# EAGLE schematic VOID01_REVA (EAGLE 7.7.0)

## Sheet 1 of 6: PI CM4
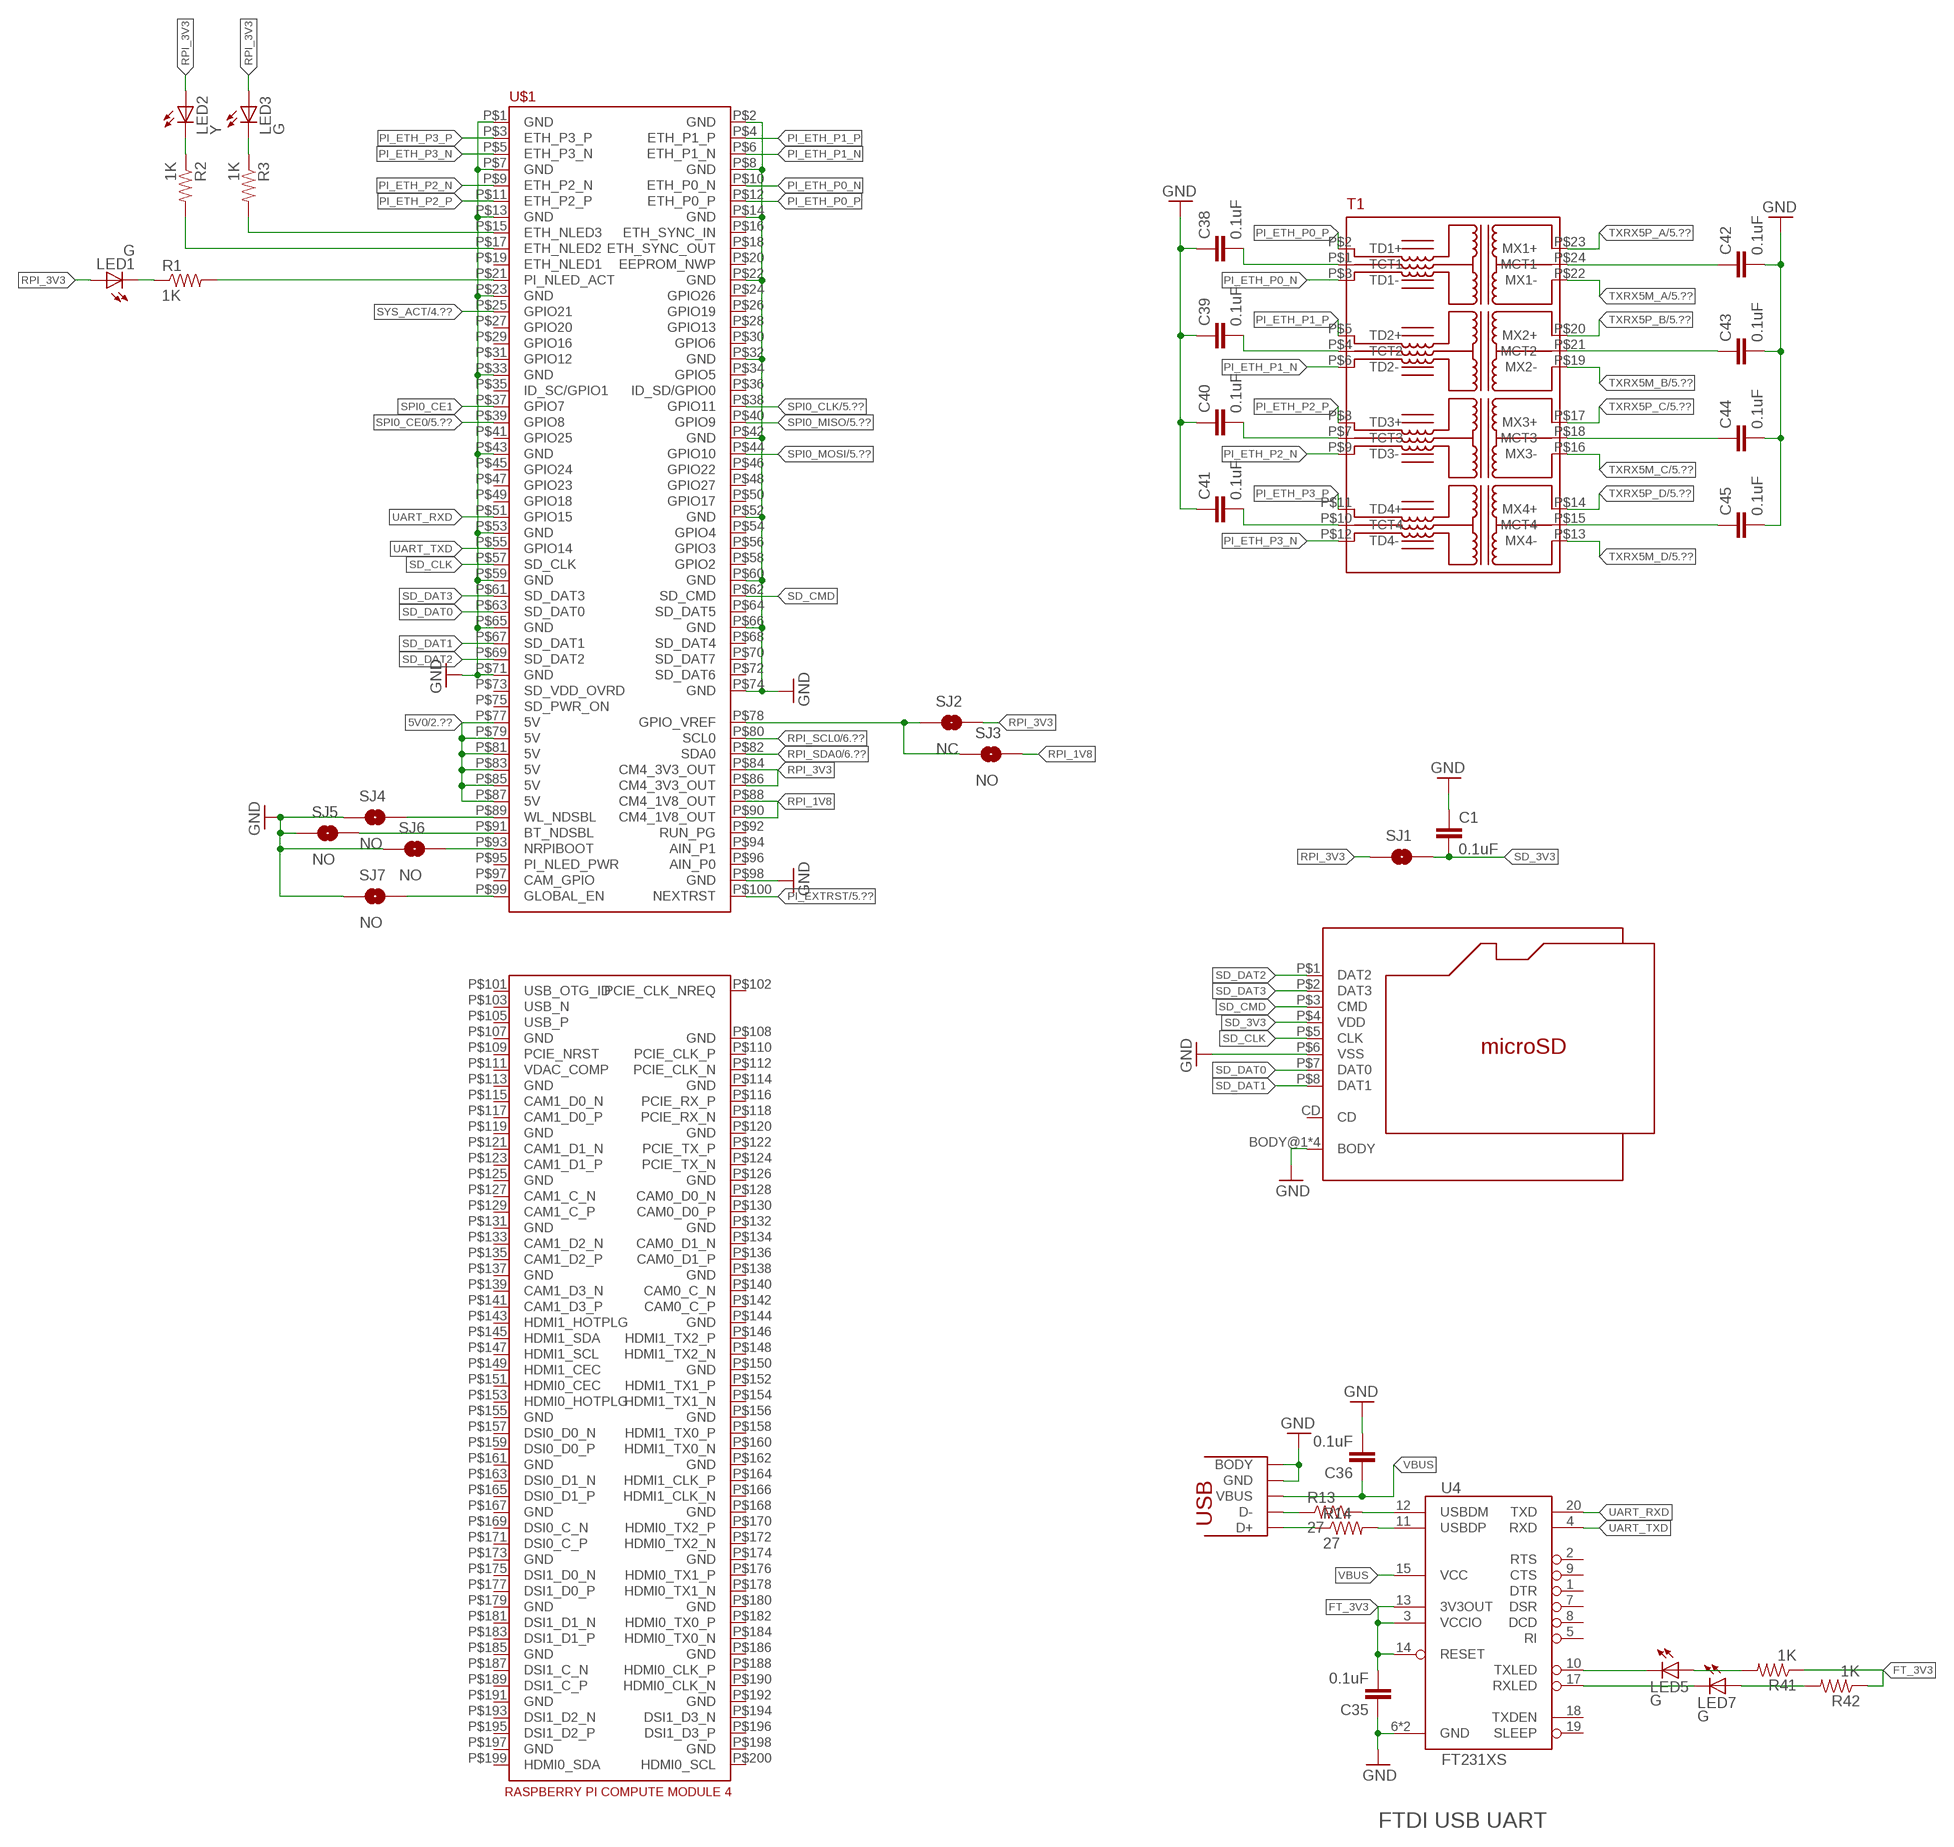
[diagram p0: schematic, sheet 1]

### Parts
C1  0.1uF  CAP0603-CAP  [0603-CAP]
C35  0.1uF  CAP0603-CAP  [0603-CAP]
C36  0.1uF  CAP0603-CAP  [0603-CAP]
C38  0.1uF  CAP0603-CAP  [0603-CAP]
C39  0.1uF  CAP0603-CAP  [0603-CAP]
C40  0.1uF  CAP0603-CAP  [0603-CAP]
C41  0.1uF  CAP0603-CAP  [0603-CAP]
C42  0.1uF  CAP0603-CAP  [0603-CAP]
C43  0.1uF  CAP0603-CAP  [0603-CAP]
C44  0.1uF  CAP0603-CAP  [0603-CAP]
C45  0.1uF  CAP0603-CAP  [0603-CAP]
J1  MICROSD  [MSD-4-A]
LED1  G  LED0603  [LED-0603]
LED2  Y  LED0603  [LED-0603]
LED3  G  LED0603  [LED-0603]
LED5  G  LED0603  [LED-0603]
LED7  G  LED0603  [LED-0603]
R1  1K  RESISTOR0402-RES  [0402-RES]
R2  1K  RESISTOR0402-RES  [0402-RES]
R3  1K  RESISTOR0402-RES  [0402-RES]
R13  27  RESISTOR0603-RES  [0603-RES]
R14  27  RESISTOR0603-RES  [0603-RES]
R41  1K  RESISTOR0603-RES  [0603-RES]
R42  1K  RESISTOR0603-RES  [0603-RES]
SJ1  SOLDERJUMPERTRACE  [SJ_2S-TRACE]
SJ2  NC  SOLDERJUMPERTRACE  [SJ_2S-TRACE]
SJ3  NO  SOLDERJUMPERNO  [SJ_2S-NO]
SJ4  NO  SOLDERJUMPERNO  [SJ_2S-NO]
SJ5  NO  SOLDERJUMPERNO  [SJ_2S-NO]
SJ6  NO  SOLDERJUMPERNO  [SJ_2S-NO]
SJ7  NO  SOLDERJUMPERNO  [SJ_2S-NO]
T1  HX6098NL  [HX6098NL]
U4  FT231XS  [SSOP-20]
U$1  RPI-CM4  [RPI-CM4]
U$2  USB-MICROB  [USB-MICROB-10118192]

### Nets
5V0: U$1.P$77(5V) U$1.P$79(5V) U$1.P$81(5V) U$1.P$83(5V) U$1.P$85(5V) U$1.P$87(5V) ; also sheet 2,4
FT_3V3: C35.2 R41.1 R42.1 U4.3(VCCIO) U4.13(3V3OUT) U4.14(RESET)
GND: C1.1 C35.1 C36.2 C38.1 C39.1 C40.1 C41.1 C42.2 C43.2 C44.2 C45.2 J1.BODY@1(BODY) J1.BODY@2(BODY) J1.BODY@3(BODY) J1.BODY@4(BODY) J1.P$6(VSS) SJ4.1 SJ5.1 SJ6.1 SJ7.1 U4.6(GND) U4.16(GND) U$1.P$1(GND) U$1.P$2(GND) U$1.P$7(GND) U$1.P$8(GND) U$1.P$13(GND) U$1.P$14(GND) U$1.P$22(GND) U$1.P$23(GND) U$1.P$32(GND) U$1.P$33(GND) U$1.P$42(GND) U$1.P$43(GND) U$1.P$52(GND) U$1.P$53(GND) U$1.P$59(GND) U$1.P$60(GND) U$1.P$65(GND) U$1.P$66(GND) U$1.P$71(GND) U$1.P$74(GND) U$1.P$98(GND) U$2.5(GND) U$2.BODY@1(BODY) U$2.BODY@2(BODY) U$2.BODY@3(BODY) U$2.BODY@4(BODY) U$2.BODY@5(BODY) U$2.BODY@6(BODY) ; also sheet 2,3,4,5,6
N$1: SJ2.1 SJ3.1 U$1.P$78(GPIO_VREF)
N$2: SJ4.2 U$1.P$89(WL_NDSBL)
N$3: SJ5.2 U$1.P$91(BT_NDSBL)
N$4: LED2.C R2.1
N$5: SJ6.2 U$1.P$93(NRPIBOOT)
N$6: R1.2 U$1.P$21(PI_NLED_ACT)
N$7: LED1.C R1.1
N$8: LED3.C R3.1
N$9: R2.2 U$1.P$17(ETH_NLED2)
N$10: R3.2 U$1.P$15(ETH_NLED3)
N$26: SJ7.2 U$1.P$99(GLOBAL_EN)
N$28: R13.1 U$2.2(D-)
N$29: R14.1 U$2.3(D+)
N$30: R14.2 U4.11(USBDP)
N$31: R13.2 U4.12(USBDM)
N$37: C38.2 T1.P$1(TCT1)
N$38: C39.2 T1.P$4(TCT2)
N$39: C40.2 T1.P$7(TCT3)
N$40: C41.2 T1.P$10(TCT4)
N$41: C45.1 T1.P$15(MCT4)
N$42: C44.1 T1.P$18(MCT3)
N$43: C43.1 T1.P$21(MCT2)
N$44: C42.1 T1.P$24(MCT1)
N$55: LED5.C U4.10(TXLED)
N$58: LED5.A R41.2
N$61: LED7.C U4.17(RXLED)
N$62: LED7.A R42.2
PI_ETH_P0_N: T1.P$3(TD1-) U$1.P$10(ETH_P0_N)
PI_ETH_P0_P: T1.P$2(TD1+) U$1.P$12(ETH_P0_P)
PI_ETH_P1_N: T1.P$6(TD2-) U$1.P$6(ETH_P1_N)
PI_ETH_P1_P: T1.P$5(TD2+) U$1.P$4(ETH_P1_P)
PI_ETH_P2_N: T1.P$9(TD3-) U$1.P$9(ETH_P2_N)
PI_ETH_P2_P: T1.P$8(TD3+) U$1.P$11(ETH_P2_P)
PI_ETH_P3_N: T1.P$12(TD4-) U$1.P$5(ETH_P3_N)
PI_ETH_P3_P: T1.P$11(TD4+) U$1.P$3(ETH_P3_P)
PI_EXTRST: U$1.P$100(NEXTRST) ; also sheet 5
RPI_1V8: SJ3.2 U$1.P$88(CM4_1V8_OUT) U$1.P$90(CM4_1V8_OUT)
RPI_3V3: LED1.A LED2.A LED3.A SJ1.1 SJ2.2 U$1.P$84(CM4_3V3_OUT) U$1.P$86(CM4_3V3_OUT)
RPI_SCL0: U$1.P$80(SCL0) ; also sheet 6
RPI_SDA0: U$1.P$82(SDA0) ; also sheet 6
SD_3V3: C1.2 J1.P$4(VDD) SJ1.2
SD_CLK: J1.P$5(CLK) U$1.P$57(SD_CLK)
SD_CMD: J1.P$3(CMD) U$1.P$62(SD_CMD)
SD_DAT0: J1.P$7(DAT0) U$1.P$63(SD_DAT0)
SD_DAT1: J1.P$8(DAT1) U$1.P$67(SD_DAT1)
SD_DAT2: J1.P$1(DAT2) U$1.P$69(SD_DAT2)
SD_DAT3: J1.P$2(DAT3) U$1.P$61(SD_DAT3)
SPI0_CE0: U$1.P$39(GPIO8) ; also sheet 5
SPI0_CE1: U$1.P$37(GPIO7)
SPI0_CLK: U$1.P$38(GPIO11) ; also sheet 5
SPI0_MISO: U$1.P$40(GPIO9) ; also sheet 5
SPI0_MOSI: U$1.P$44(GPIO10) ; also sheet 5
SYS_ACT: U$1.P$25(GPIO21) ; also sheet 4
TXRX5M_A: T1.P$22(MX1-) ; also sheet 5
TXRX5M_B: T1.P$19(MX2-) ; also sheet 5
TXRX5M_C: T1.P$16(MX3-) ; also sheet 5
TXRX5M_D: T1.P$13(MX4-) ; also sheet 5
TXRX5P_A: T1.P$23(MX1+) ; also sheet 5
TXRX5P_B: T1.P$20(MX2+) ; also sheet 5
TXRX5P_C: T1.P$17(MX3+) ; also sheet 5
TXRX5P_D: T1.P$14(MX4+) ; also sheet 5
UART_RXD: U4.20(TXD) U$1.P$51(GPIO15)
UART_TXD: U4.4(RXD) U$1.P$55(GPIO14)
VBUS: C36.1 U4.15(VCC) U$2.1(VBUS)
Unconnected: J1.CD U4.1(DTR) U4.2(RTS) U4.5(RI) U4.7(DSR) U4.8(DCD) U4.9(CTS) U4.18(TXDEN) U4.19(SLEEP) U$1.P$16(ETH_SYNC_IN) U$1.P$18(ETH_SYNC_OUT) U$1.P$19(ETH_NLED1) U$1.P$20(EEPROM_NWP) U$1.P$24(GPIO26) U$1.P$26(GPIO19) U$1.P$27(GPIO20) U$1.P$28(GPIO13) U$1.P$29(GPIO16) U$1.P$30(GPIO6) U$1.P$31(GPIO12) U$1.P$34(GPIO5) U$1.P$35(ID_SC/GPIO1) U$1.P$36(ID_SD/GPIO0) U$1.P$41(GPIO25) U$1.P$45(GPIO24) U$1.P$46(GPIO22) U$1.P$47(GPIO23) U$1.P$48(GPIO27) U$1.P$49(GPIO18) U$1.P$50(GPIO17) U$1.P$54(GPIO4) U$1.P$56(GPIO3) U$1.P$58(GPIO2) U$1.P$64(SD_DAT5) U$1.P$68(SD_DAT4) U$1.P$70(SD_DAT7) U$1.P$72(SD_DAT6) U$1.P$73(SD_VDD_OVRD) U$1.P$75(SD_PWR_ON) U$1.P$92(RUN_PG) U$1.P$94(AIN_P1) U$1.P$95(PI_NLED_PWR) U$1.P$96(AIN_P0) U$1.P$97(CAM_GPIO) U$1.P$101(USB_OTG_ID) U$1.P$102(PCIE_CLK_NREQ) U$1.P$103(USB_N) U$1.P$105(USB_P) U$1.P$107(GND) U$1.P$108(GND) U$1.P$109(PCIE_NRST) U$1.P$110(PCIE_CLK_P) U$1.P$111(VDAC_COMP) U$1.P$112(PCIE_CLK_N) U$1.P$113(GND) U$1.P$114(GND) U$1.P$115(CAM1_D0_N) U$1.P$116(PCIE_RX_P) U$1.P$117(CAM1_D0_P) U$1.P$118(PCIE_RX_N) U$1.P$119(GND) U$1.P$120(GND) U$1.P$121(CAM1_D1_N) U$1.P$122(PCIE_TX_P) U$1.P$123(CAM1_D1_P) U$1.P$124(PCIE_TX_N) U$1.P$125(GND) U$1.P$126(GND) U$1.P$127(CAM1_C_N) U$1.P$128(CAM0_D0_N) U$1.P$129(CAM1_C_P) U$1.P$130(CAM0_D0_P) U$1.P$131(GND) U$1.P$132(GND) U$1.P$133(CAM1_D2_N) U$1.P$134(CAM0_D1_N) U$1.P$135(CAM1_D2_P) U$1.P$136(CAM0_D1_P) U$1.P$137(GND) U$1.P$138(GND) U$1.P$139(CAM1_D3_N) U$1.P$140(CAM0_C_N) U$1.P$141(CAM1_D3_P) U$1.P$142(CAM0_C_P) U$1.P$143(HDMI1_HOTPLG) U$1.P$144(GND) U$1.P$145(HDMI1_SDA) U$1.P$146(HDMI1_TX2_P) U$1.P$147(HDMI1_SCL) U$1.P$148(HDMI1_TX2_N) U$1.P$149(HDMI1_CEC) U$1.P$150(GND) U$1.P$151(HDMI0_CEC) U$1.P$152(HDMI1_TX1_P) U$1.P$153(HDMI0_HOTPLG) U$1.P$154(HDMI1_TX1_N) U$1.P$155(GND) U$1.P$156(GND) U$1.P$157(DSI0_D0_N) U$1.P$158(HDMI1_TX0_P) U$1.P$159(DSI0_D0_P) U$1.P$160(HDMI1_TX0_N) U$1.P$161(GND) U$1.P$162(GND) U$1.P$163(DSI0_D1_N) U$1.P$164(HDMI1_CLK_P) U$1.P$165(DSI0_D1_P) U$1.P$166(HDMI1_CLK_N) U$1.P$167(GND) U$1.P$168(GND) U$1.P$169(DSI0_C_N) U$1.P$170(HDMI0_TX2_P) U$1.P$171(DSI0_C_P) U$1.P$172(HDMI0_TX2_N) U$1.P$173(GND) U$1.P$174(GND) U$1.P$175(DSI1_D0_N) U$1.P$176(HDMI0_TX1_P) U$1.P$177(DSI1_D0_P) U$1.P$178(HDMI0_TX1_N) U$1.P$179(GND) U$1.P$180(GND) U$1.P$181(DSI1_D1_N) U$1.P$182(HDMI0_TX0_P) U$1.P$183(DSI1_D1_P) U$1.P$184(HDMI0_TX0_N) U$1.P$185(GND) U$1.P$186(GND) U$1.P$187(DSI1_C_N) U$1.P$188(HDMI0_CLK_P) U$1.P$189(DSI1_C_P) U$1.P$190(HDMI0_CLK_N) U$1.P$191(GND) U$1.P$192(GND) U$1.P$193(DSI1_D2_N) U$1.P$194(DSI1_D3_N) U$1.P$195(DSI1_D2_P) U$1.P$196(DSI1_D3_P) U$1.P$197(GND) U$1.P$198(GND) U$1.P$199(HDMI0_SDA) U$1.P$200(HDMI0_SCL)

### Notes on the sheet
- FTDI USB UART

## Sheet 2 of 6: 5V SUPPLY
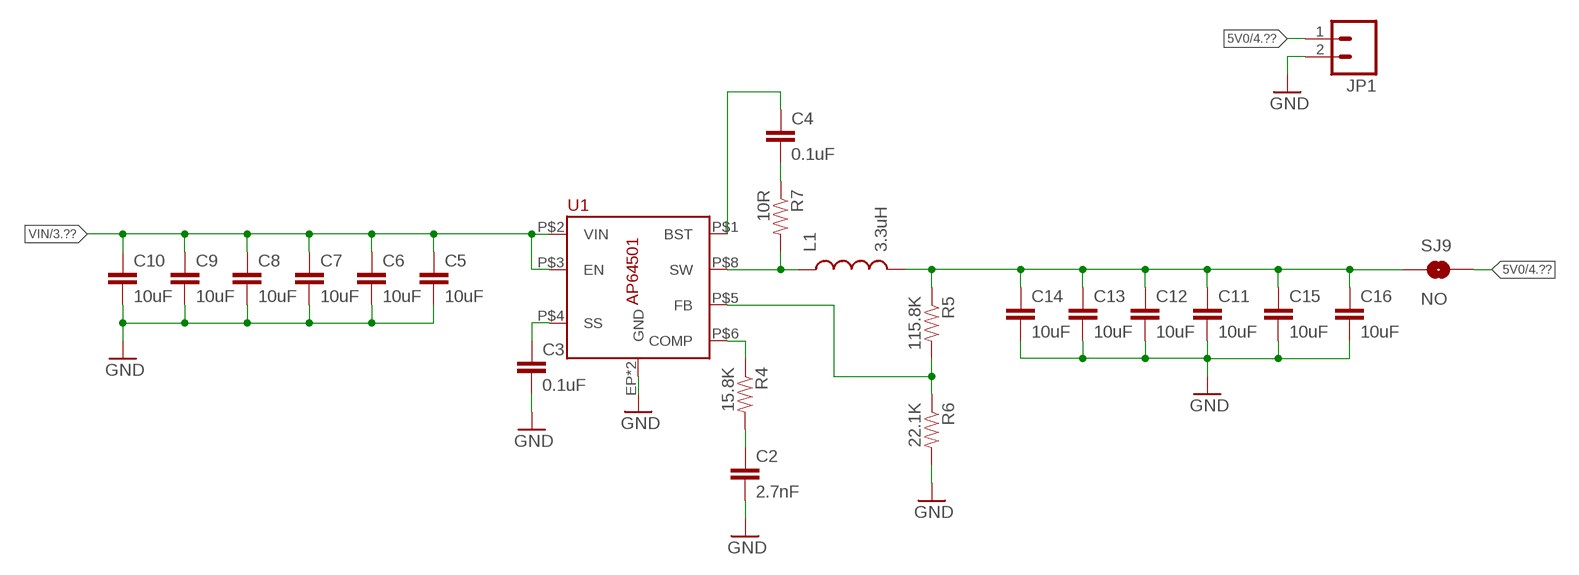
[diagram p1: schematic, sheet 2]

### Parts
C2  2.7nF  CAP0603-CAP  [0603-CAP]
C3  0.1uF  CAP0603-CAP  [0603-CAP]
C4  0.1uF  CAP0603-CAP  [0603-CAP]
C5  10uF  CAP1206  [1206]
C6  10uF  CAP1206  [1206]
C7  10uF  CAP1206  [1206]
C8  10uF  CAP1206  [1206]
C9  10uF  CAP1206  [1206]
C10  10uF  CAP1206  [1206]
C11  10uF  CAP1206  [1206]
C12  10uF  CAP1206  [1206]
C13  10uF  CAP1206  [1206]
C14  10uF  CAP1206  [1206]
C15  10uF  CAP1206  [1206]
C16  10uF  CAP1206  [1206]
JP1  M02PTH3  [1X02_LONGPADS]
L1  3.3uH  INDUCTORSRN6045TA  [SRN6045TA]
R4  15.8K  RESISTOR0603-RES  [0603-RES]
R5  115.8K  RESISTOR0603-RES  [0603-RES]
R6  22.1K  RESISTOR0603-RES  [0603-RES]
R7  10R  RESISTOR0603-RES  [0603-RES]
SJ9  NO  SOLDERJUMPERNO  [SJ_2S-NO]
U1  AP64501  [SO-8EP]

### Nets
5V0: JP1.1 SJ9.2 ; also sheet 1,4
GND: C2.2 C3.2 C5.2 C6.2 C7.2 C8.2 C9.2 C10.2 C11.2 C12.2 C13.2 C14.2 C15.2 C16.2 JP1.2 R6.2 U1.EP(GND) U1.P$7(GND) ; also sheet 1,3,4,5,6
N$11: C3.1 U1.P$4(SS)
N$12: R4.1 U1.P$6(COMP)
N$13: C2.1 R4.2
N$14: R5.2 R6.1 U1.P$5(FB)
N$17: L1.P$1 R7.2 U1.P$8(SW)
N$18: C4.2 R7.1
N$19: C4.1 U1.P$1(BST)
N$46: C11.1 C12.1 C13.1 C14.1 C15.1 C16.1 L1.P$2 R5.1 SJ9.1
VIN: C5.1 C6.1 C7.1 C8.1 C9.1 C10.1 U1.P$2(VIN) U1.P$3(EN) ; also sheet 3,4

## Sheet 3 of 6: 1V2 SUPPLY
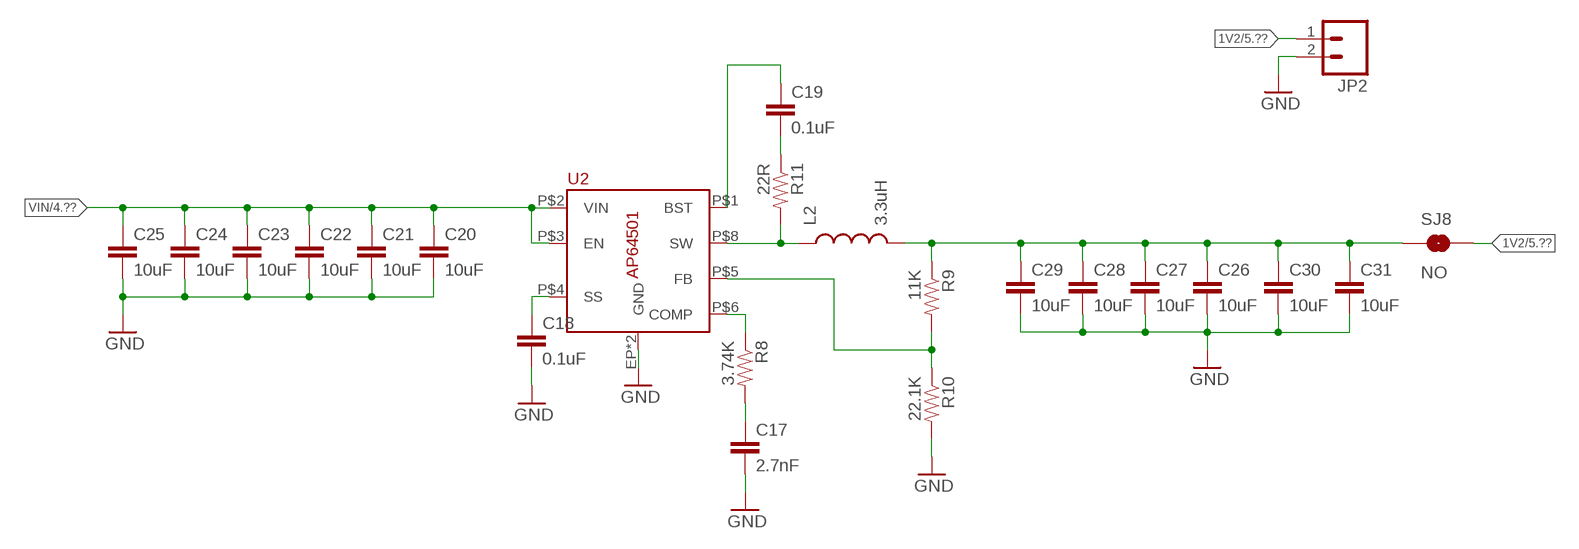
[diagram p2: schematic, sheet 3]

### Parts
C17  2.7nF  CAP0603-CAP  [0603-CAP]
C18  0.1uF  CAP0603-CAP  [0603-CAP]
C19  0.1uF  CAP0603-CAP  [0603-CAP]
C20  10uF  CAP1206  [1206]
C21  10uF  CAP1206  [1206]
C22  10uF  CAP1206  [1206]
C23  10uF  CAP1206  [1206]
C24  10uF  CAP1206  [1206]
C25  10uF  CAP1206  [1206]
C26  10uF  CAP1206  [1206]
C27  10uF  CAP1206  [1206]
C28  10uF  CAP1206  [1206]
C29  10uF  CAP1206  [1206]
C30  10uF  CAP1206  [1206]
C31  10uF  CAP1206  [1206]
JP2  M02PTH3  [1X02_LONGPADS]
L2  3.3uH  INDUCTORSRN6045TA  [SRN6045TA]
R8  3.74K  RESISTOR0603-RES  [0603-RES]
R9  11K  RESISTOR0603-RES  [0603-RES]
R10  22.1K  RESISTOR0603-RES  [0603-RES]
R11  22R  RESISTOR0603-RES  [0603-RES]
SJ8  NO  SOLDERJUMPERNO  [SJ_2S-NO]
U2  AP64501  [SO-8EP]

### Nets
1V2: JP2.1 SJ8.2 ; also sheet 5
GND: C17.2 C18.2 C20.2 C21.2 C22.2 C23.2 C24.2 C25.2 C26.2 C27.2 C28.2 C29.2 C30.2 C31.2 JP2.2 R10.2 U2.EP(GND) U2.P$7(GND) ; also sheet 1,2,4,5,6
N$15: C18.1 U2.P$4(SS)
N$16: R8.1 U2.P$6(COMP)
N$20: C17.1 R8.2
N$21: R9.2 R10.1 U2.P$5(FB)
N$22: L2.P$1 R11.2 U2.P$8(SW)
N$23: C19.2 R11.1
N$24: C19.1 U2.P$1(BST)
N$47: C26.1 C27.1 C28.1 C29.1 C30.1 C31.1 L2.P$2 R9.1 SJ8.1
VIN: C20.1 C21.1 C22.1 C23.1 C24.1 C25.1 U2.P$2(VIN) U2.P$3(EN) ; also sheet 2,4

## Sheet 4 of 6: INPUT & LDOs
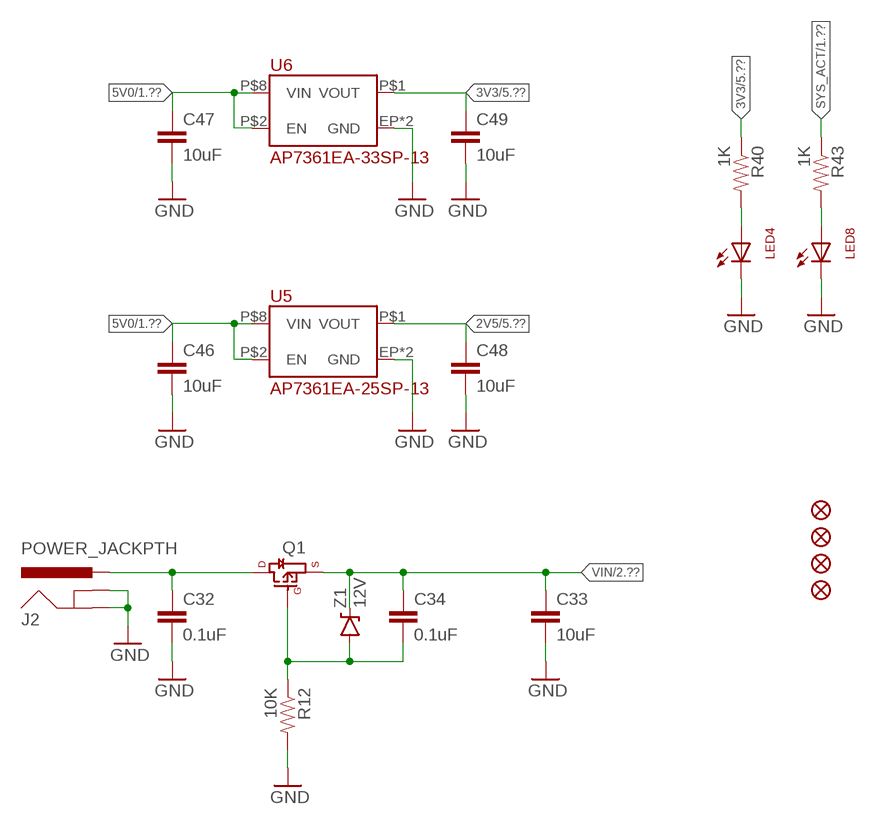
[diagram p3: schematic, sheet 4]

### Parts
C32  0.1uF  CAP0603-CAP  [0603-CAP]
C33  10uF  CAP1206  [1206]
C34  0.1uF  CAP0603-CAP  [0603-CAP]
C46  10uF  CAP1206  [1206]
C47  10uF  CAP1206  [1206]
C48  10uF  CAP1206  [1206]
C49  10uF  CAP1206  [1206]
FID1  FIDUCIAL  [FIDUCIAL]
FID2  FIDUCIAL  [FIDUCIAL]
FID3  FIDUCIAL  [FIDUCIAL]
FID4  FIDUCIAL  [FIDUCIAL]
J2  POWER_JACKPTH  [POWER_JACK_PTH]
LED4  LED  [LED_QBL7XX80D-MP4A]
LED8  LED  [LED_QBL7XX80D-MP4A]
Q1  MOSFET_P_CHANNELDMP4015SSS  [SO08]
R12  10K  RESISTOR0603-RES  [0603-RES]
R40  1K  RESISTOR0603-RES  [0603-RES]
R43  1K  RESISTOR0603-RES  [0603-RES]
U5  AP7361EA-25SP-13  AP7361EA_SO8_EP  [SO-8EP]
U6  AP7361EA-33SP-13  AP7361EA_SO8_EP  [SO-8EP]
Z1  12V  DIODE-ZENERSOT-23  [SOT-23]

### Nets
2V5: C48.1 U5.P$1(VOUT) ; also sheet 5
3V3: C49.1 R40.1 U6.P$1(VOUT) ; also sheet 5,6
5V0: C46.1 C47.1 U5.P$2(EN) U5.P$8(VIN) U6.P$2(EN) U6.P$8(VIN) ; also sheet 1,2
GND: C32.2 C33.2 C46.2 C47.2 C48.2 C49.2 J2.GND J2.GNDBREAK LED4.C LED8.C R12.2 U5.EP(GND) U5.P$4(GND) U6.EP(GND) U6.P$4(GND) ; also sheet 1,2,3,5,6
N$25: C32.1 J2.PWR Q1.5(D) Q1.6(D) Q1.7(D) Q1.8(D)
N$27: C34.2 Q1.4(G) R12.1 Z1.1(A)
N$51: LED8.A R43.2
N$92: LED4.A R40.2
SYS_ACT: R43.1 ; also sheet 1
VIN: C33.1 C34.1 Q1.1(S) Q1.2(S) Q1.3(S) Z1.3(C) ; also sheet 2,3

## Sheet 5 of 6: SWITCH
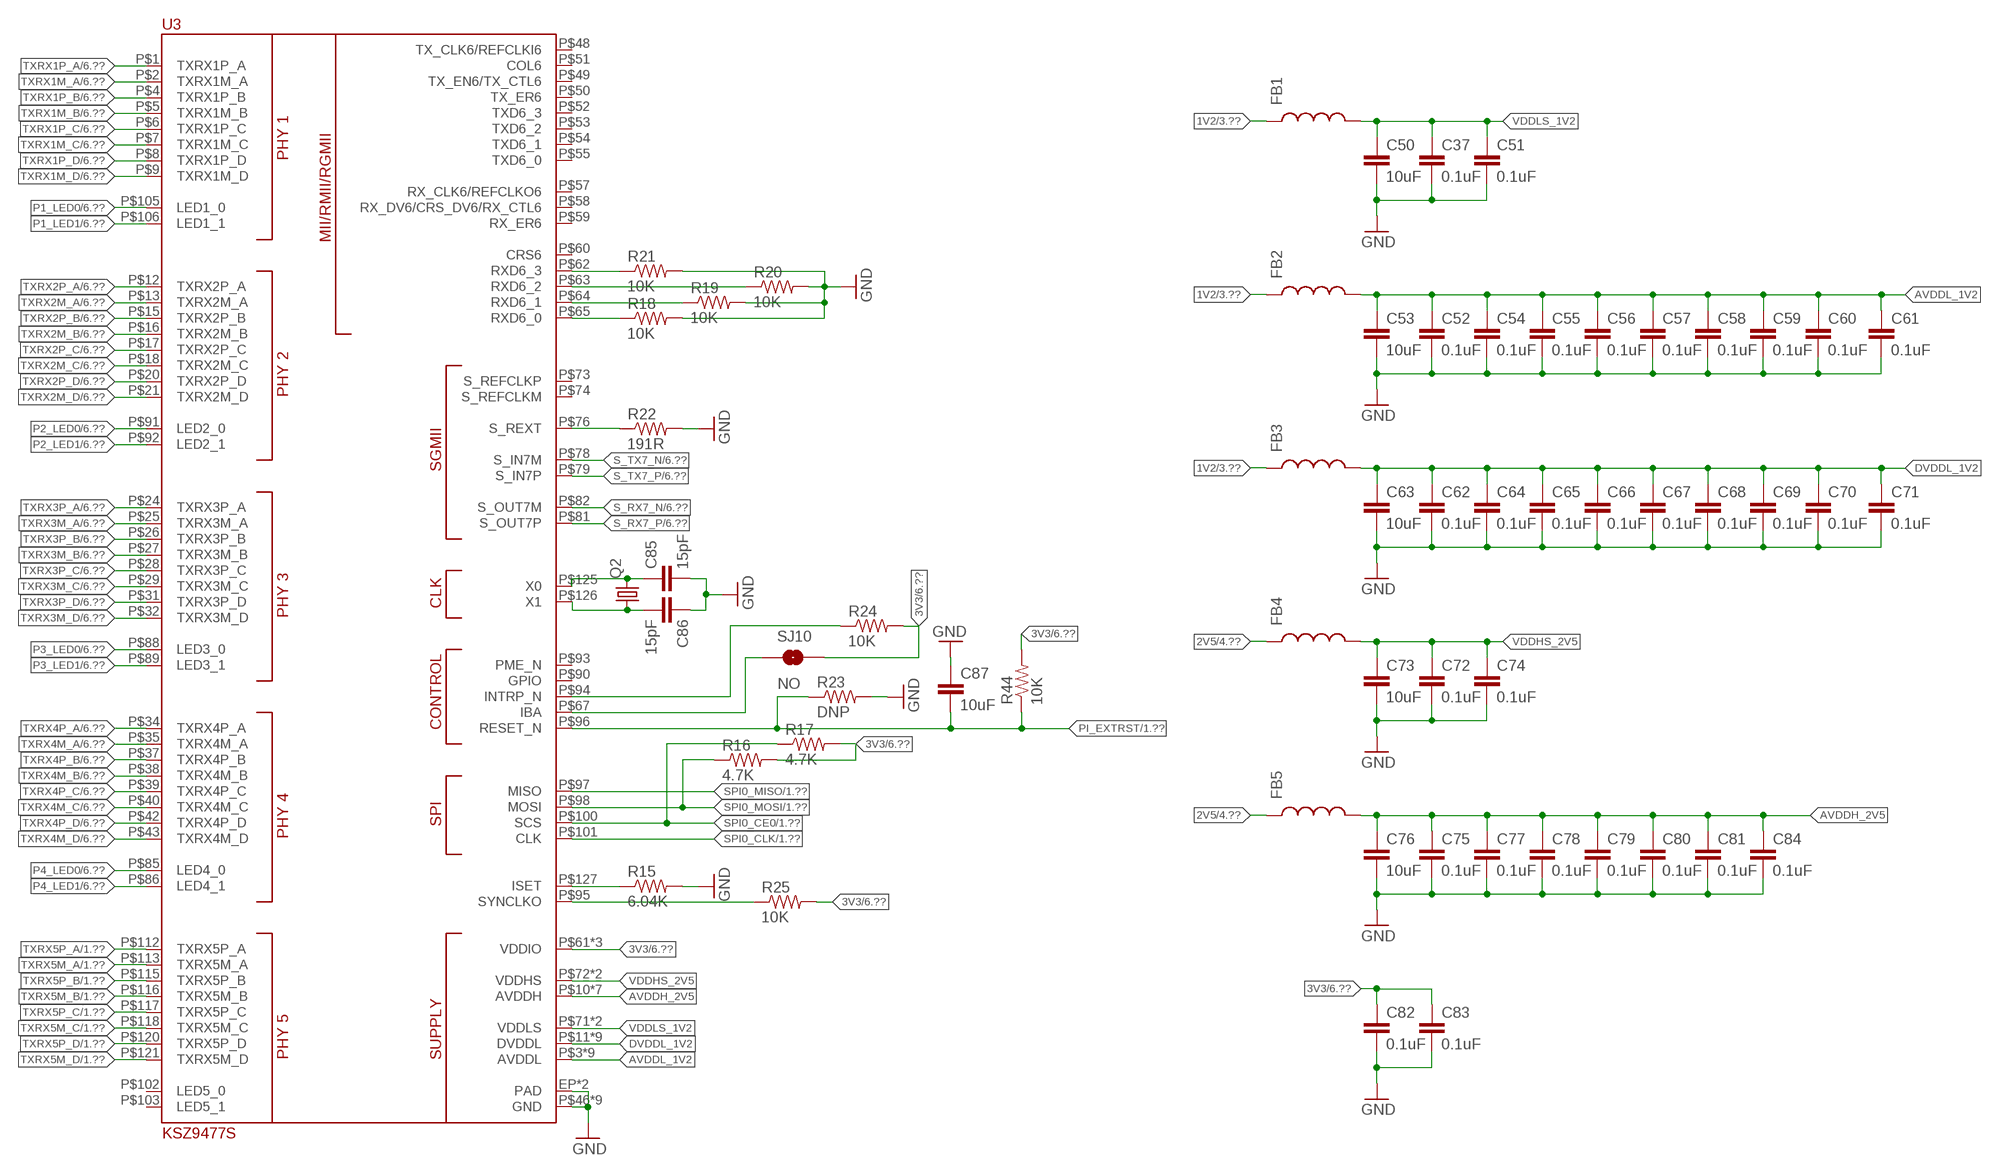
[diagram p4: schematic, sheet 5]

### Parts
C37  0.1uF  CAP0402-CAP  [0402-CAP]
C50  10uF  CAP1206  [1206]
C51  0.1uF  CAP0402-CAP  [0402-CAP]
C52  0.1uF  CAP0402-CAP  [0402-CAP]
C53  10uF  CAP1206  [1206]
C54  0.1uF  CAP0402-CAP  [0402-CAP]
C55  0.1uF  CAP0402-CAP  [0402-CAP]
C56  0.1uF  CAP0402-CAP  [0402-CAP]
C57  0.1uF  CAP0402-CAP  [0402-CAP]
C58  0.1uF  CAP0402-CAP  [0402-CAP]
C59  0.1uF  CAP0402-CAP  [0402-CAP]
C60  0.1uF  CAP0402-CAP  [0402-CAP]
C61  0.1uF  CAP0402-CAP  [0402-CAP]
C62  0.1uF  CAP0402-CAP  [0402-CAP]
C63  10uF  CAP1206  [1206]
C64  0.1uF  CAP0402-CAP  [0402-CAP]
C65  0.1uF  CAP0402-CAP  [0402-CAP]
C66  0.1uF  CAP0402-CAP  [0402-CAP]
C67  0.1uF  CAP0402-CAP  [0402-CAP]
C68  0.1uF  CAP0402-CAP  [0402-CAP]
C69  0.1uF  CAP0402-CAP  [0402-CAP]
C70  0.1uF  CAP0402-CAP  [0402-CAP]
C71  0.1uF  CAP0402-CAP  [0402-CAP]
C72  0.1uF  CAP0402-CAP  [0402-CAP]
C73  10uF  CAP1206  [1206]
C74  0.1uF  CAP0402-CAP  [0402-CAP]
C75  0.1uF  CAP0402-CAP  [0402-CAP]
C76  10uF  CAP1206  [1206]
C77  0.1uF  CAP0402-CAP  [0402-CAP]
C78  0.1uF  CAP0402-CAP  [0402-CAP]
C79  0.1uF  CAP0402-CAP  [0402-CAP]
C80  0.1uF  CAP0402-CAP  [0402-CAP]
C81  0.1uF  CAP0402-CAP  [0402-CAP]
C82  0.1uF  CAP0402-CAP  [0402-CAP]
C83  0.1uF  CAP0402-CAP  [0402-CAP]
C84  0.1uF  CAP0402-CAP  [0402-CAP]
C85  15pF  CAP0402-CAP  [0402-CAP]
C86  15pF  CAP0402-CAP  [0402-CAP]
C87  10uF  CAP1206  [1206]
FB1  INDUCTOR0805  [0805]
FB2  INDUCTOR0805  [0805]
FB3  INDUCTOR0805  [0805]
FB4  INDUCTOR0805  [0805]
FB5  INDUCTOR0805  [0805]
Q2  CRYSTAL3.2X2.5  [CRYSTAL_3.2X2.5]
R15  6.04K  RESISTOR0402-RES  [0402-RES]
R16  4.7K  RESISTOR0402-RES  [0402-RES]
R17  4.7K  RESISTOR0402-RES  [0402-RES]
R18  10K  RESISTOR0402-RES  [0402-RES]
R19  10K  RESISTOR0402-RES  [0402-RES]
R20  10K  RESISTOR0402-RES  [0402-RES]
R21  10K  RESISTOR0402-RES  [0402-RES]
R22  191R  RESISTOR0402-RES  [0402-RES]
R23  DNP  RESISTOR0402-RES  [0402-RES]
R24  10K  RESISTOR0402-RES  [0402-RES]
R25  10K  RESISTOR0402-RES  [0402-RES]
R44  10K  RESISTOR0402-RES  [0402-RES]
SJ10  NO  SOLDERJUMPERNO  [SJ_2S-NO]
U3  KSZ9477S  [TQFP-128-EP]

### Nets
1V2: FB1.1 FB2.1 FB3.1 ; also sheet 3
2V5: FB4.1 FB5.1 ; also sheet 4
3V3: C82.1 C83.1 R16.2 R17.2 R24.2 R25.2 R44.2 SJ10.2 U3.P$61(VDDIO) U3.P$68(VDDIO) U3.P$99(VDDIO) ; also sheet 4,6
AVDDH_2V5: C75.1 C76.1 C77.1 C78.1 C79.1 C80.1 C81.1 C84.1 FB5.2 U3.P$10(AVDDH) U3.P$22(AVDDH) U3.P$33(AVDDH) U3.P$44(AVDDH) U3.P$111(AVDDH) U3.P$122(AVDDH) U3.P$128(AVDDH)
AVDDL_1V2: C52.1 C53.1 C54.1 C55.1 C56.1 C57.1 C58.1 C59.1 C60.1 C61.1 FB2.2 U3.P$3(AVDDL) U3.P$14(AVDDL) U3.P$19(AVDDL) U3.P$30(AVDDL) U3.P$36(AVDDL) U3.P$41(AVDDL) U3.P$114(AVDDL) U3.P$119(AVDDL) U3.P$124(AVDDL)
DVDDL_1V2: C62.1 C63.1 C64.1 C65.1 C66.1 C67.1 C68.1 C69.1 C70.1 C71.1 FB3.2 U3.P$11(DVDDL) U3.P$23(DVDDL) U3.P$45(DVDDL) U3.P$56(DVDDL) U3.P$66(DVDDL) U3.P$70(DVDDL) U3.P$87(DVDDL) U3.P$104(DVDDL) U3.P$110(DVDDL)
GND: C37.2 C50.2 C51.2 C52.2 C53.2 C54.2 C55.2 C56.2 C57.2 C58.2 C59.2 C60.2 C61.2 C62.2 C63.2 C64.2 C65.2 C66.2 C67.2 C68.2 C69.2 C70.2 C71.2 C72.2 C73.2 C74.2 C75.2 C76.2 C77.2 C78.2 C79.2 C80.2 C81.2 C82.2 C83.2 C84.2 C85.2 C86.1 C87.1 R15.2 R18.2 R19.2 R20.2 R21.2 R22.2 R23.2 U3.EP1(PAD) U3.EP(PAD) U3.P$46(GND) U3.P$47(GND) U3.P$69(GND) U3.P$75(GND) U3.P$77(GND) U3.P$80(GND) U3.P$107(GND) U3.P$109(GND) U3.P$123(GND) ; also sheet 1,2,3,4,6
N$32: R15.1 U3.P$127(ISET)
N$33: R21.1 U3.P$62(RXD6_3)
N$34: R20.1 U3.P$63(RXD6_2)
N$35: R19.1 U3.P$64(RXD6_1)
N$36: R18.1 U3.P$65(RXD6_0)
N$45: R22.1 U3.P$76(S_REXT)
N$48: R25.1 U3.P$95(SYNCLKO)
N$81: R24.1 U3.P$94(INTRP_N)
N$82: SJ10.1 U3.P$67(IBA)
N$83: C86.2 Q2.P$1 U3.P$126(X1)
N$85: C85.1 Q2.P$3 U3.P$125(X0)
P1_LED0: U3.P$105(LED1_0) ; also sheet 6
P1_LED1: U3.P$106(LED1_1) ; also sheet 6
P2_LED0: U3.P$91(LED2_0) ; also sheet 6
P2_LED1: U3.P$92(LED2_1) ; also sheet 6
P3_LED0: U3.P$88(LED3_0) ; also sheet 6
P3_LED1: U3.P$89(LED3_1) ; also sheet 6
P4_LED0: U3.P$85(LED4_0) ; also sheet 6
P4_LED1: U3.P$86(LED4_1) ; also sheet 6
PI_EXTRST: C87.2 R23.1 R44.1 U3.P$96(RESET_N) ; also sheet 1
S_RX7_N: U3.P$82(S_OUT7M) ; also sheet 6
S_RX7_P: U3.P$81(S_OUT7P) ; also sheet 6
S_TX7_N: U3.P$78(S_IN7M) ; also sheet 6
S_TX7_P: U3.P$79(S_IN7P) ; also sheet 6
SPI0_CE0: R17.1 U3.P$100(SCS) ; also sheet 1
SPI0_CLK: U3.P$101(CLK) ; also sheet 1
SPI0_MISO: U3.P$97(MISO) ; also sheet 1
SPI0_MOSI: R16.1 U3.P$98(MOSI) ; also sheet 1
TXRX1M_A: U3.P$2(TXRX1M_A) ; also sheet 6
TXRX1M_B: U3.P$5(TXRX1M_B) ; also sheet 6
TXRX1M_C: U3.P$7(TXRX1M_C) ; also sheet 6
TXRX1M_D: U3.P$9(TXRX1M_D) ; also sheet 6
TXRX1P_A: U3.P$1(TXRX1P_A) ; also sheet 6
TXRX1P_B: U3.P$4(TXRX1P_B) ; also sheet 6
TXRX1P_C: U3.P$6(TXRX1P_C) ; also sheet 6
TXRX1P_D: U3.P$8(TXRX1P_D) ; also sheet 6
TXRX2M_A: U3.P$13(TXRX2M_A) ; also sheet 6
TXRX2M_B: U3.P$16(TXRX2M_B) ; also sheet 6
TXRX2M_C: U3.P$18(TXRX2M_C) ; also sheet 6
TXRX2M_D: U3.P$21(TXRX2M_D) ; also sheet 6
TXRX2P_A: U3.P$12(TXRX2P_A) ; also sheet 6
TXRX2P_B: U3.P$15(TXRX2P_B) ; also sheet 6
TXRX2P_C: U3.P$17(TXRX2P_C) ; also sheet 6
TXRX2P_D: U3.P$20(TXRX2P_D) ; also sheet 6
TXRX3M_A: U3.P$25(TXRX3M_A) ; also sheet 6
TXRX3M_B: U3.P$27(TXRX3M_B) ; also sheet 6
TXRX3M_C: U3.P$29(TXRX3M_C) ; also sheet 6
TXRX3M_D: U3.P$32(TXRX3M_D) ; also sheet 6
TXRX3P_A: U3.P$24(TXRX3P_A) ; also sheet 6
TXRX3P_B: U3.P$26(TXRX3P_B) ; also sheet 6
TXRX3P_C: U3.P$28(TXRX3P_C) ; also sheet 6
TXRX3P_D: U3.P$31(TXRX3P_D) ; also sheet 6
TXRX4M_A: U3.P$35(TXRX4M_A) ; also sheet 6
TXRX4M_B: U3.P$38(TXRX4M_B) ; also sheet 6
TXRX4M_C: U3.P$40(TXRX4M_C) ; also sheet 6
TXRX4M_D: U3.P$43(TXRX4M_D) ; also sheet 6
TXRX4P_A: U3.P$34(TXRX4P_A) ; also sheet 6
TXRX4P_B: U3.P$37(TXRX4P_B) ; also sheet 6
TXRX4P_C: U3.P$39(TXRX4P_C) ; also sheet 6
TXRX4P_D: U3.P$42(TXRX4P_D) ; also sheet 6
TXRX5M_A: U3.P$113(TXRX5M_A) ; also sheet 1
TXRX5M_B: U3.P$116(TXRX5M_B) ; also sheet 1
TXRX5M_C: U3.P$118(TXRX5M_C) ; also sheet 1
TXRX5M_D: U3.P$121(TXRX5M_D) ; also sheet 1
TXRX5P_A: U3.P$112(TXRX5P_A) ; also sheet 1
TXRX5P_B: U3.P$115(TXRX5P_B) ; also sheet 1
TXRX5P_C: U3.P$117(TXRX5P_C) ; also sheet 1
TXRX5P_D: U3.P$120(TXRX5P_D) ; also sheet 1
VDDHS_2V5: C72.1 C73.1 C74.1 FB4.2 U3.P$72(VDDHS) U3.P$83(VDDHS)
VDDLS_1V2: C37.1 C50.1 C51.1 FB1.2 U3.P$71(VDDLS) U3.P$84(VDDLS)
Unconnected: U3.P$48(TX_CLK6/REFCLKI6) U3.P$49(TX_EN6/TX_CTL6) U3.P$50(TX_ER6) U3.P$51(COL6) U3.P$52(TXD6_3) U3.P$53(TXD6_2) U3.P$54(TXD6_1) U3.P$55(TXD6_0) U3.P$57(RX_CLK6/REFCLKO6) U3.P$58(RX_DV6/CRS_DV6/RX_CTL6) U3.P$59(RX_ER6) U3.P$60(CRS6) U3.P$73(S_REFCLKP) U3.P$74(S_REFCLKM) U3.P$90(GPIO) U3.P$93(PME_N) U3.P$102(LED5_0) U3.P$103(LED5_1)

## Sheet 6 of 6: NET PORTS
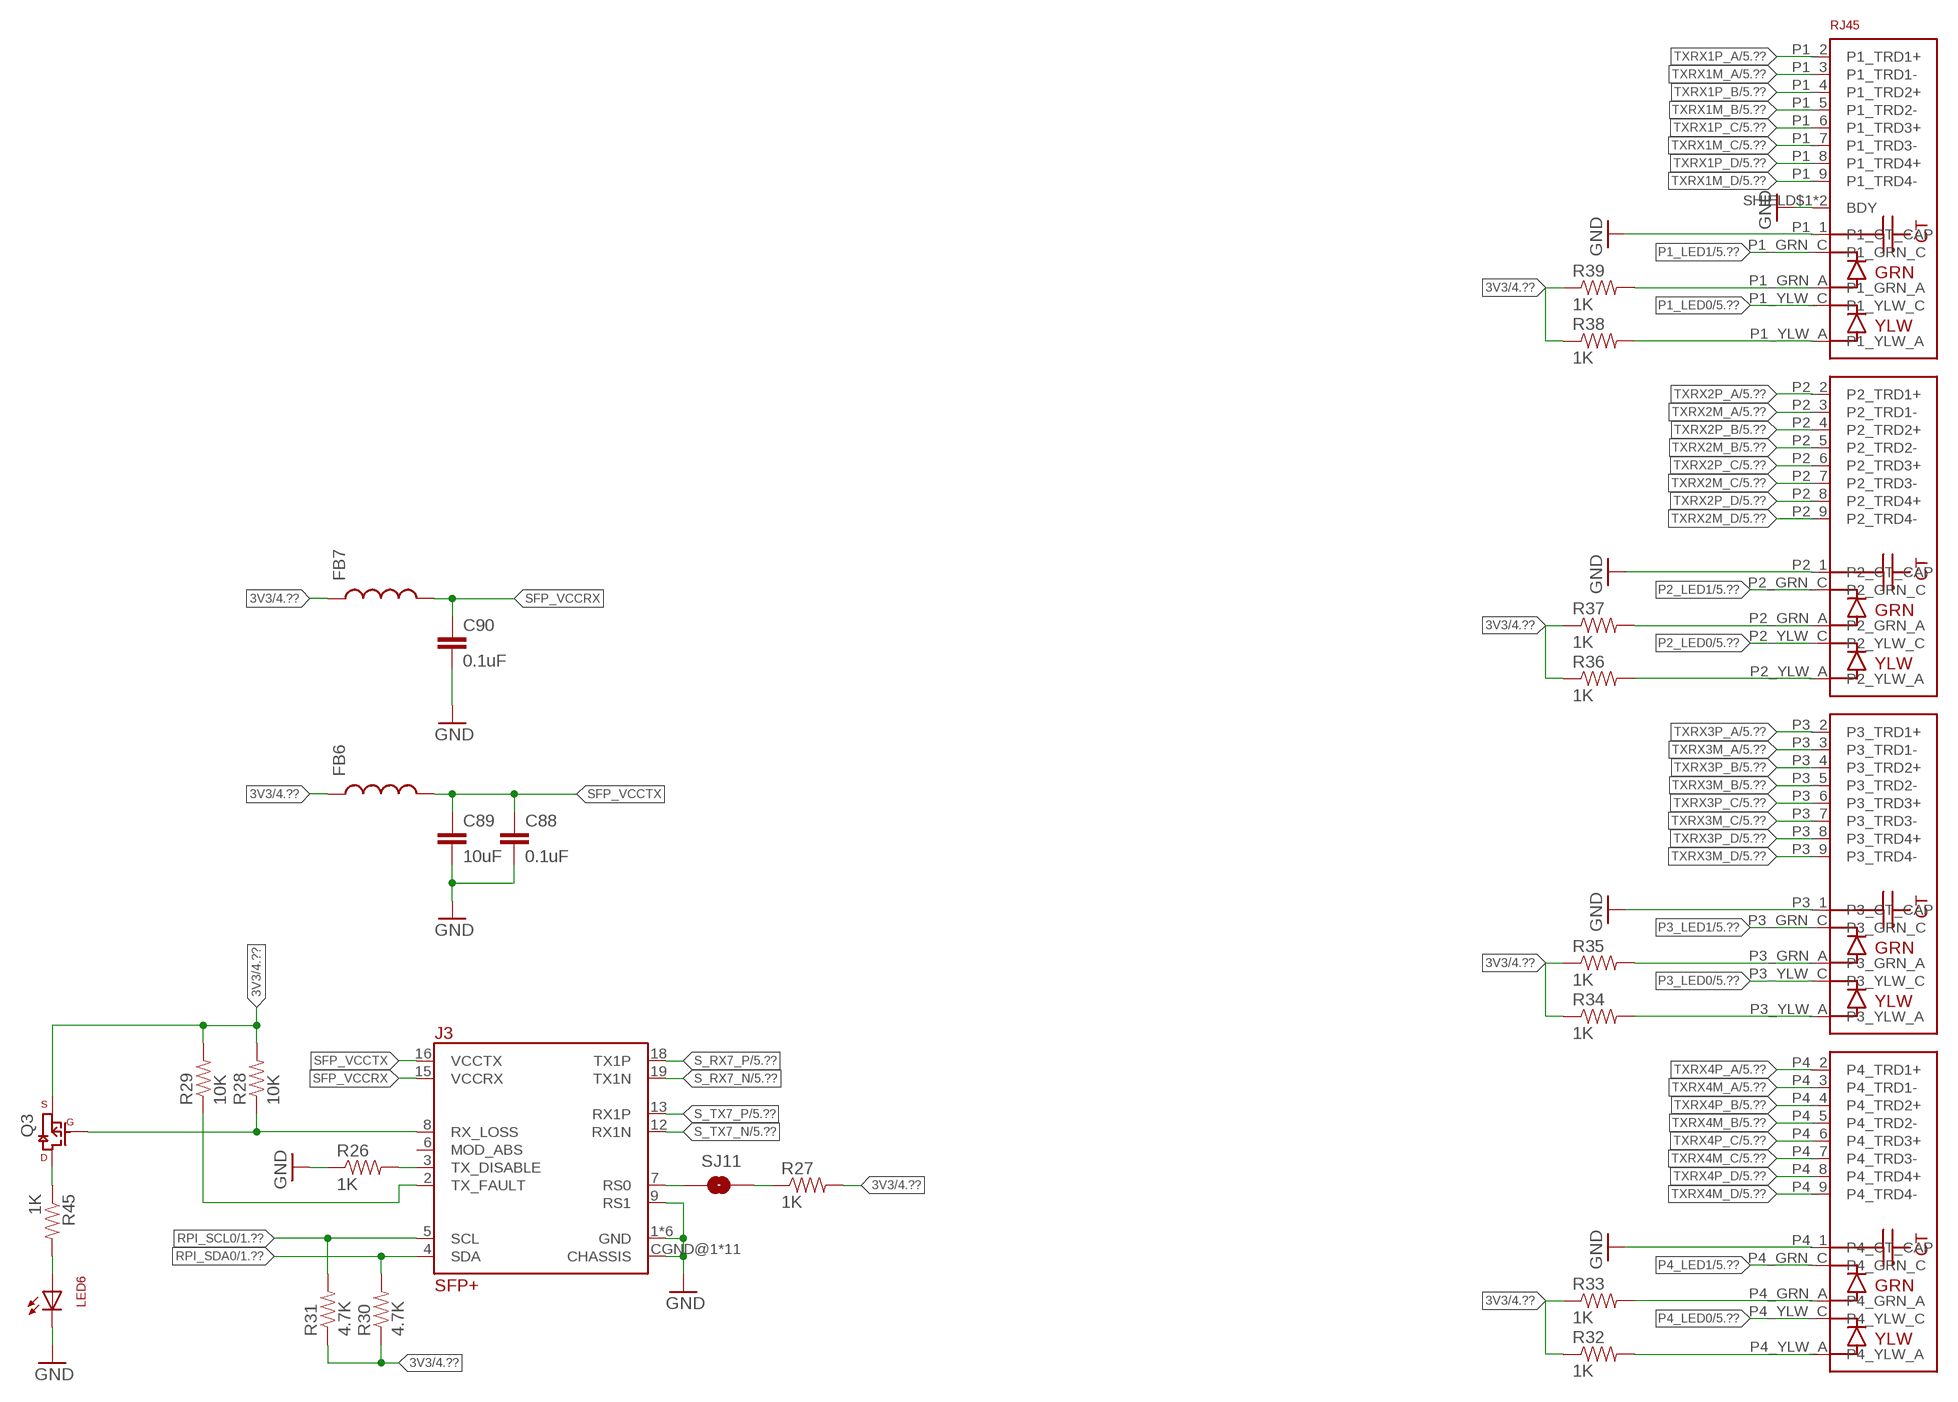
[diagram p5: schematic, sheet 6]

### Parts
C88  0.1uF  CAP0402-CAP  [0402-CAP]
C89  10uF  CAP1206  [1206]
C90  0.1uF  CAP0402-CAP  [0402-CAP]
FB6  INDUCTOR0805  [0805]
FB7  INDUCTOR0805  [0805]
J3  SFP  SFP+  [SFP_SOCKET_CAGE]
J4  JXD0-4015NL  [JXD0-4015NL]
LED6  LED  [LED_QBL7XX80D-MP4A]
Q3  MOSFET_P_CHANNELAO3423  [SOT-23]
R26  1K  RESISTOR0402-RES  [0402-RES]
R27  1K  RESISTOR0402-RES  [0402-RES]
R28  10K  RESISTOR0603-RES  [0603-RES]
R29  10K  RESISTOR0402-RES  [0402-RES]
R30  4.7K  RESISTOR0402-RES  [0402-RES]
R31  4.7K  RESISTOR0402-RES  [0402-RES]
R32  1K  RESISTOR0603-RES  [0603-RES]
R33  1K  RESISTOR0603-RES  [0603-RES]
R34  1K  RESISTOR0603-RES  [0603-RES]
R35  1K  RESISTOR0603-RES  [0603-RES]
R36  1K  RESISTOR0603-RES  [0603-RES]
R37  1K  RESISTOR0603-RES  [0603-RES]
R38  1K  RESISTOR0603-RES  [0603-RES]
R39  1K  RESISTOR0603-RES  [0603-RES]
R45  1K  RESISTOR0603-RES  [0603-RES]
SJ11  SOLDERJUMPERNO  [SJ_2S-NO]

### Nets
3V3: FB6.1 FB7.1 Q3.2(S) R27.2 R28.2 R29.2 R30.1 R31.1 R32.1 R33.1 R34.1 R35.1 R36.1 R37.1 R38.1 R39.1 ; also sheet 4,5
GND: C88.2 C89.2 C90.2 J3.1(GND) J3.9(RS1) J3.10(GND) J3.11(GND) J3.14(GND) J3.17(GND) J3.20(GND) J3.CGND@1(CHASSIS) J3.CGND@6(CHASSIS) J3.CGND@9(CHASSIS) J3.CGND@11(CHASSIS) J3.CGND@12(CHASSIS) J3.CGND@13(CHASSIS) J3.CGND@14(CHASSIS) J3.CGND@15(CHASSIS) J3.CGND@16(CHASSIS) J3.CGND@19(CHASSIS) J3.CGND@20(CHASSIS) J4.P1_1(P1_CT_CAP) J4.P2_1(P2_CT_CAP) J4.P3_1(P3_CT_CAP) J4.P4_1(P4_CT_CAP) J4.SHIELD$1(BDY) J4.SHIELD$5(BDY) LED6.C R26.1 ; also sheet 1,2,3,4,5
N$49: J4.P4_YLW_A R32.2
N$50: J4.P4_GRN_A R33.2
N$53: J4.P3_GRN_A R35.2
N$54: J4.P3_YLW_A R34.2
N$56: J4.P2_GRN_A R37.2
N$57: J4.P2_YLW_A R36.2
N$59: J4.P1_GRN_A R39.2
N$60: J4.P1_YLW_A R38.2
N$84: J3.3(TX_DISABLE) R26.2
N$86: J3.7(RS0) SJ11.1
N$87: R27.1 SJ11.2
N$88: J3.8(RX_LOSS) Q3.1(G) R28.1
N$89: J3.2(TX_FAULT) R29.1
N$90: LED6.A R45.2
N$91: Q3.3(D) R45.1
P1_LED0: J4.P1_YLW_C ; also sheet 5
P1_LED1: J4.P1_GRN_C ; also sheet 5
P2_LED0: J4.P2_YLW_C ; also sheet 5
P2_LED1: J4.P2_GRN_C ; also sheet 5
P3_LED0: J4.P3_YLW_C ; also sheet 5
P3_LED1: J4.P3_GRN_C ; also sheet 5
P4_LED0: J4.P4_YLW_C ; also sheet 5
P4_LED1: J4.P4_GRN_C ; also sheet 5
RPI_SCL0: J3.5(SCL) R31.2 ; also sheet 1
RPI_SDA0: J3.4(SDA) R30.2 ; also sheet 1
S_RX7_N: J3.19(TX1N) ; also sheet 5
S_RX7_P: J3.18(TX1P) ; also sheet 5
S_TX7_N: J3.12(RX1N) ; also sheet 5
S_TX7_P: J3.13(RX1P) ; also sheet 5
SFP_VCCRX: C90.1 FB7.2 J3.15(VCCRX)
SFP_VCCTX: C88.1 C89.1 FB6.2 J3.16(VCCTX)
TXRX1M_A: J4.P1_3(P1_TRD1-) ; also sheet 5
TXRX1M_B: J4.P1_5(P1_TRD2-) ; also sheet 5
TXRX1M_C: J4.P1_7(P1_TRD3-) ; also sheet 5
TXRX1M_D: J4.P1_9(P1_TRD4-) ; also sheet 5
TXRX1P_A: J4.P1_2(P1_TRD1+) ; also sheet 5
TXRX1P_B: J4.P1_4(P1_TRD2+) ; also sheet 5
TXRX1P_C: J4.P1_6(P1_TRD3+) ; also sheet 5
TXRX1P_D: J4.P1_8(P1_TRD4+) ; also sheet 5
TXRX2M_A: J4.P2_3(P2_TRD1-) ; also sheet 5
TXRX2M_B: J4.P2_5(P2_TRD2-) ; also sheet 5
TXRX2M_C: J4.P2_7(P2_TRD3-) ; also sheet 5
TXRX2M_D: J4.P2_9(P2_TRD4-) ; also sheet 5
TXRX2P_A: J4.P2_2(P2_TRD1+) ; also sheet 5
TXRX2P_B: J4.P2_4(P2_TRD2+) ; also sheet 5
TXRX2P_C: J4.P2_6(P2_TRD3+) ; also sheet 5
TXRX2P_D: J4.P2_8(P2_TRD4+) ; also sheet 5
TXRX3M_A: J4.P3_3(P3_TRD1-) ; also sheet 5
TXRX3M_B: J4.P3_5(P3_TRD2-) ; also sheet 5
TXRX3M_C: J4.P3_7(P3_TRD3-) ; also sheet 5
TXRX3M_D: J4.P3_9(P3_TRD4-) ; also sheet 5
TXRX3P_A: J4.P3_2(P3_TRD1+) ; also sheet 5
TXRX3P_B: J4.P3_4(P3_TRD2+) ; also sheet 5
TXRX3P_C: J4.P3_6(P3_TRD3+) ; also sheet 5
TXRX3P_D: J4.P3_8(P3_TRD4+) ; also sheet 5
TXRX4M_A: J4.P4_3(P4_TRD1-) ; also sheet 5
TXRX4M_B: J4.P4_5(P4_TRD2-) ; also sheet 5
TXRX4M_C: J4.P4_7(P4_TRD3-) ; also sheet 5
TXRX4M_D: J4.P4_9(P4_TRD4-) ; also sheet 5
TXRX4P_A: J4.P4_2(P4_TRD1+) ; also sheet 5
TXRX4P_B: J4.P4_4(P4_TRD2+) ; also sheet 5
TXRX4P_C: J4.P4_6(P4_TRD3+) ; also sheet 5
TXRX4P_D: J4.P4_8(P4_TRD4+) ; also sheet 5
Unconnected: J3.6(MOD_ABS)

## Library data of the parts
C1-C90 = SparkFun:CAP: Capacitor Standard 0603 ceramic capacitor, and 0.1" leaded capacitor.
FB1-FB7 = SparkFun:INDUCTOR: Inductors Basic Inductor/Choke - 0603 and 1206. Footprints are not proven and vary greatly between part numbers.
FID1-FID4 = Nigel:FIDUCIAL
J1 = Nigel:MICROSD
J2 = SparkFun:POWER_JACK: Power Jack This is the standard 5.5mm barrel jack for power. The PTH is the most common, proven, reliable, footprint. All others are experimental. The Slot footprint only works if the mill layer is transmitted to the PCB fab house so be warned. Spark Fun Electronics SKU : PRT-00119. Mating wall wart : TOL-00298 (and others)
J3 = Nigel:SFP+
J4 = Nigel:JXD0-4015NL: Pulse JXD0-4015NL Quad Magjack RJ45
JP1 JP2 = SparkFun:M02: Header 2 Standard 2-pin 0.1" header. Use with straight break away headers (SKU : PRT-00116), right angle break away headers (PRT-00553), swiss pins (PRT-00743), machine pins (PRT-00117), and female headers (PRT-00115). Molex polarized connector foot print use with SKU : PRT-08233 with associated crimp pins and housings.
L1 L2 = Nigel:INDUCTOR
LED1-LED3 LED5 LED7 = SparkFun:LED: LEDs Standard schematic elements and footprints for 5mm, 3mm, 1206, and 0603 sized LEDs. 5mm - Spark Fun Electronics SKU : COM-00529 (and others)
LED4 LED6 LED8 = Nigel:LED
Q1 Q3 = Nigel:MOSFET_P_CHANNEL: P-Channel MOSFET
Q2 = Nigel:CRYSTAL
R1-R45 = SparkFun:RESISTOR: Resistor Basic schematic elements and footprints for 0603, 1206, and PTH resistors.
SJ1-SJ11 = SparkFun:SOLDERJUMPER: Solder Jumper Standard SMD solder jumper. Used to automate production. Two varients : Normally Open and Normally Closed are the same, but have different paste layers. NC will have a large amount of paste and should jumper during reflow.
T1 = Nigel:HX6098NL
U1 U2 = Nigel:AP64501: Diodes Incorporated AP64501 Buck Regulator
U3 = Nigel:KSZ9477S
U4 = Nigel:FT231XS: FT231XS USB to Full Handshake UART
U5 U6 = Nigel:AP7361EA
U$1 = Nigel:RPI-CM4
U$2 = Nigel:USB: USB Micro B Connector Ampehnol Part 10118192-0001LF
Z1 = Nigel:DIODE-ZENER